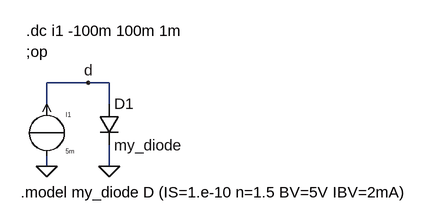
[diagram p0: schematic diode_2.asc]
diode_2.asc, the LTspice schematic file:
Version 4
SHEET 1 880 680
WIRE 192 80 128 80
WIRE 224 80 192 80
WIRE 128 112 128 80
WIRE 224 112 224 80
WIRE 128 208 128 192
WIRE 224 208 224 176
FLAG 192 80 d
FLAG 224 208 0
FLAG 128 208 0
SYMBOL diode 208 112 R0
SYMATTR InstName D1
SYMATTR Value my_diode
SYMBOL source-I 128 112 R0
SYMATTR InstName I1
SYMATTR Value 5m
TEXT 96 32 Left 2 !;op
TEXT 96 0 Left 2 !.dc i1 -100m 100m 1m
TEXT 88 248 Left 2 !.model my_diode D (IS=1.e-10 n=1.5 BV=5V IBV=2mA)

The netlist it stands for:
* diode_2.asc
D1 d 0 my_diode
I1 0 d 5m
.model D D
.lib standard.dio
;op
.dc i1 -100m 100m 1m
.model my_diode D (IS=1.e-10 n=1.5 BV=5V IBV=2mA)
.backanno
.end